# EAGLE design micamp (EAGLE 6.4)
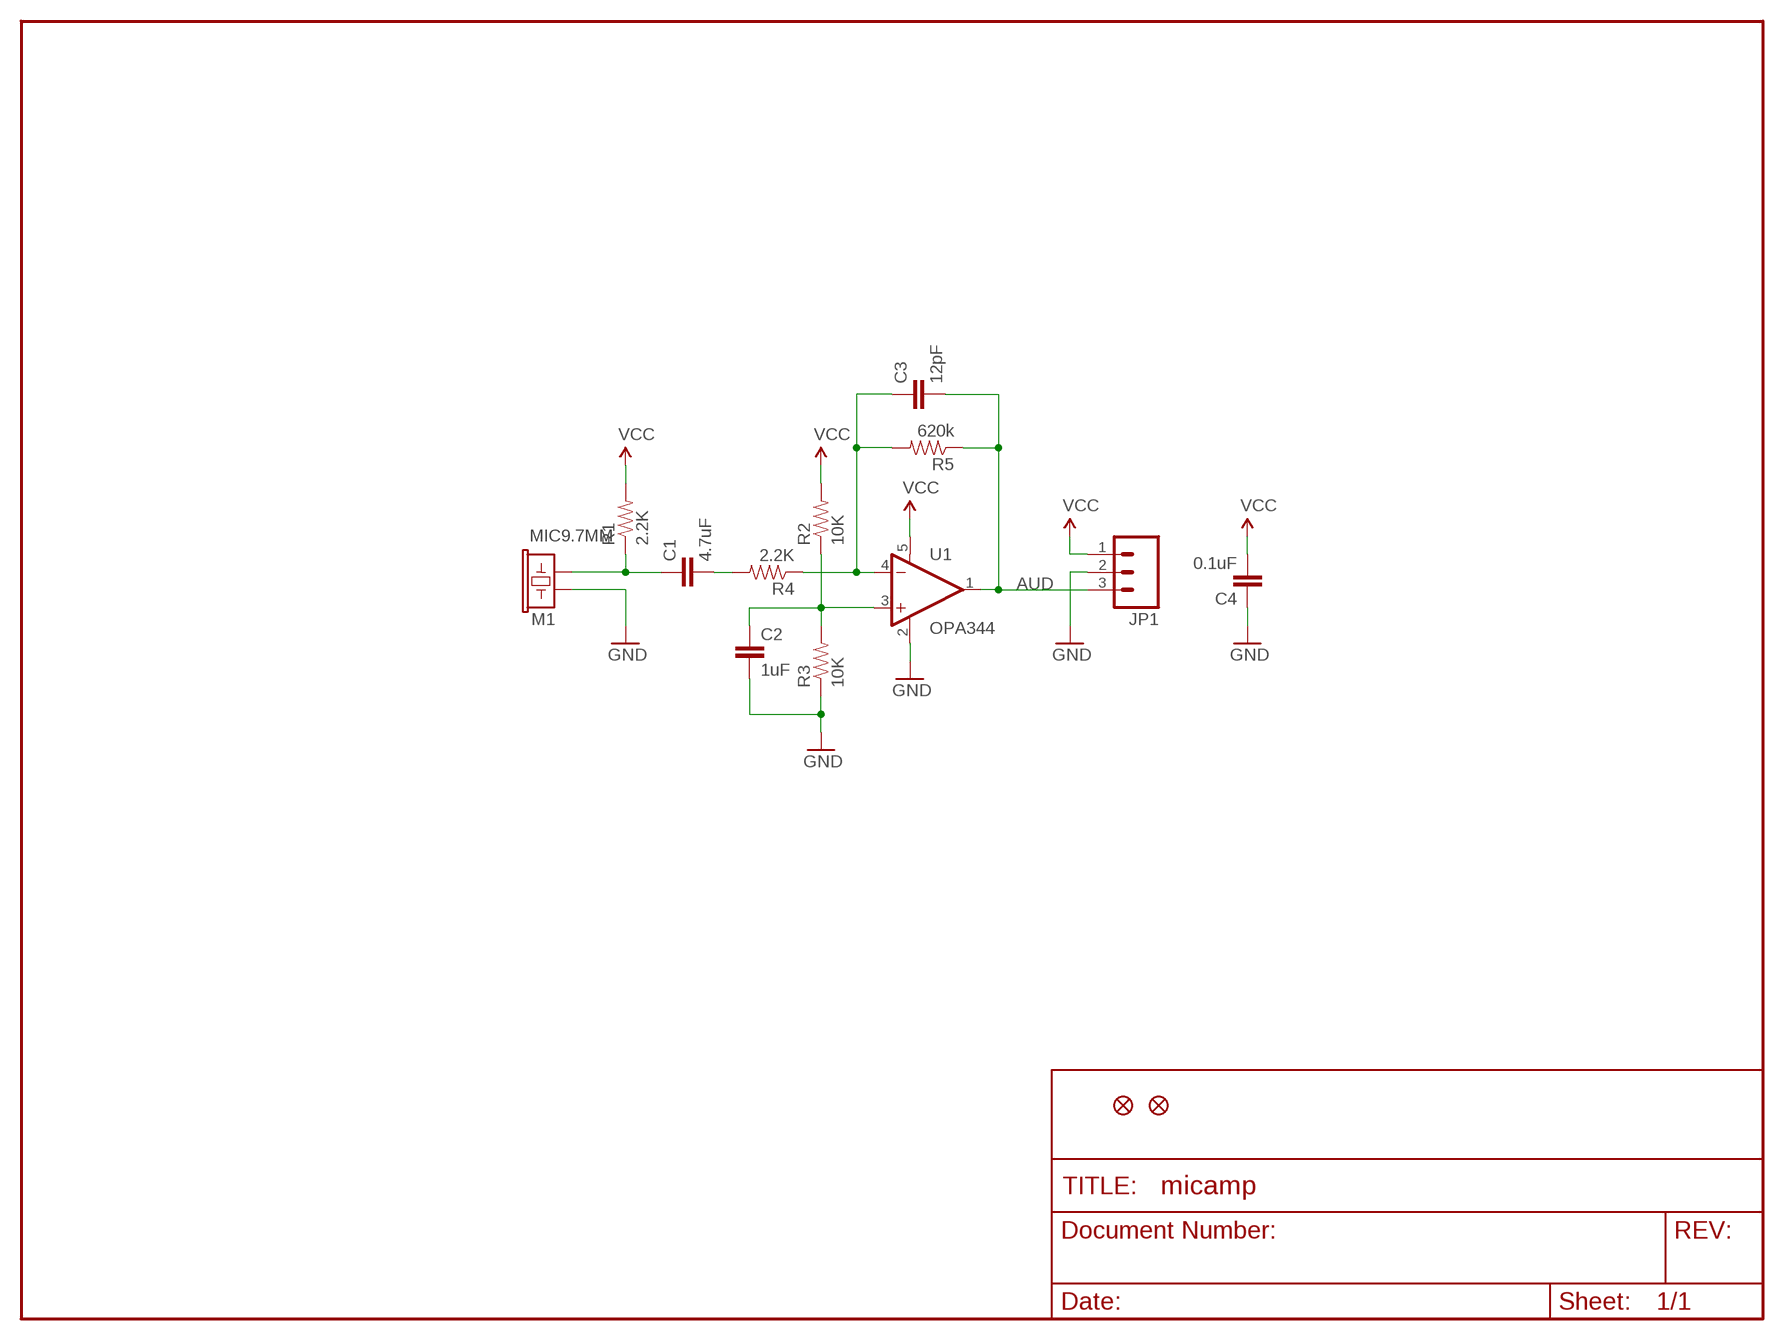
[diagram p0: schematic, sheet 1]

## Parts
C1  4.7uF  CAP0603-CAP  [0603-CAP]
C2  1uF  CAP0603-CAP  [0603-CAP]
C3  12pF  CAP0603-CAP  [0603-CAP]
C4  0.1uF  CAP0603-CAP  [0603-CAP]
JP1  M03PTH  [1X03]
JP2  FIDUCIAL1X2  [FIDUCIAL-1X2]
JP3  FIDUCIAL1X2  [FIDUCIAL-1X2]
M1  MIC9.7MM  [MIC-9.7MM]
R1  2.2K  RESISTOR0603-RES  [0603-RES]
R2  10K  RESISTOR0603-RES  [0603-RES]
R3  10K  RESISTOR0603-RES  [0603-RES]
R4  2.2K  RESISTOR0603-RES  [0603-RES]
R5  620k  RESISTOR0603-RES  [0603-RES]
U1  OPA344  [SOT23-5]

## Nets
AUD: C3.2 JP1.3 R5.1 U1.1(OUT)
GND: C2.2 C4.1 JP1.2 M1.2 R3.1 U1.2(V-)
N$1: C1.1 M1.1 R1.1
N$2: C3.1 R4.1 R5.2 U1.4(-IN)
N$6: C1.2 R4.2
N$7: C2.1 R2.1 R3.2 U1.3(+IN)
VCC: C4.2 JP1.1 R1.2 R2.2 U1.5(V+)

## Library data of the parts
C1-C4 = SparkFun:CAP: Capacitor Standard 0603 ceramic capacitor, and 0.1" leaded capacitor.
JP1 = SparkFun:M03: Header 3 Standard 3-pin 0.1" header. Use with straight break away headers (SKU : PRT-00116), right angle break away headers (PRT-00553), swiss pins (PRT-00743), machine pins (PRT-00117), and female headers (PRT-00115). Molex polarized connector foot print use with SKU : PRT-08232 with associated crimp pins and housings.
JP2 JP3 = SparkFun:FIDUCIAL: Fiducial Alignment Points Various fiducial points for machine vision alignment.
M1 = SparkFun:MIC: Microphone Omni-directional electret microphone. 9.7mm standard diameter.
R1-R5 = SparkFun:RESISTOR: Resistor Basic schematic elements and footprints for 0603, 1206, and PTH 1/10th watt (small) resistors.
U1 = SparkFun:OPA344

## Board
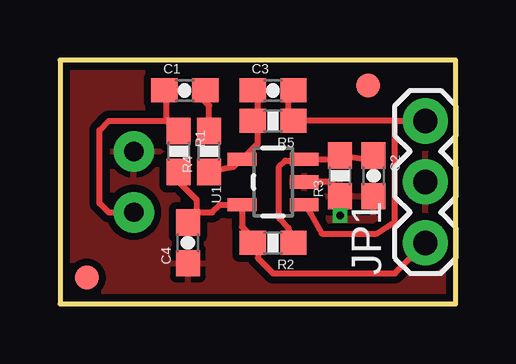
[diagram p1: board, top side]
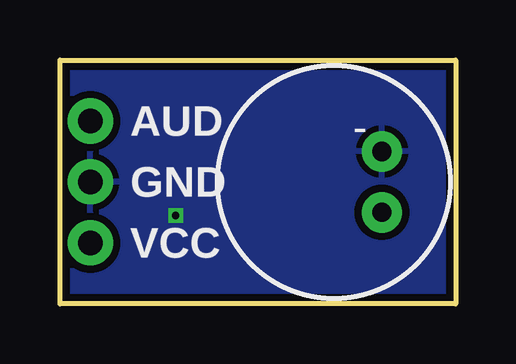
[diagram p2: board, bottom side, seen from below]

Size 16.51 x 10.16 mm. Coordinates in mm from the lower left corner, seen from the top.
Outline: 0,0 16.51,0 16.51,10.16 0,10.16 0,0
Copper layers (1*16): Top 0.035mm / dielectric 1.5mm / Bottom 0.035mm
Design rules "Fusion_eagle_rule_v1.1": minimum track width 6mil, minimum drill 12mil, track to track 6mil, track to pad 6mil, pad to pad 6mil, via to via 6mil, smd to smd 0mil, copper to edge 10mil, drill to drill 10mil, minimum pad ring 10mil, minimum via ring 6mil, stop-mask expansion 2mil, vias tented up to drill 100mil, thermal gap 10mil

### Footprints (pad centres in the part's own frame; a part is rotated, then mirrored left to right if it is on the bottom)
0603-CAP = smd 1.1 x 1: 1 -0.85,0; 2 0.85,0
1X03 = drill 1.016 pad 1.88: 1 0,0; 2 2.54,0; 3 5.08,0
FIDUCIAL-1X2 = smd 1 x 1: 1 0,0
MIC-9.7MM = drill 0.8 pad 1.676: 1 -2,1.27; 2 -2,-1.27
0603-RES = smd 1.1 x 1: 1 -0.85,0; 2 0.85,0
SOT23-5 = smd 0.55 x 1.2: 1 -0.95,-1.3; 2 0,-1.3; 3 0.95,-1.3; 4 0.95,1.3; 5 -0.95,1.3

### Placement (x,y rotation side)
C1  5.21,8.89 0 top
C2  13.08,5.33 270 top
C3  8.89,8.89 0 top
C4  5.33,2.54 90 top
JP1  15.24,2.54 90 top
JP2  12.85,9.09 0 top
JP3  1.12,1.09 0 top
M1  5.08,5.08 180 bottom
R1  4.95,6.35 270 top
R2  8.89,2.54 180 top
R3  11.68,5.33 90 top
R4  6.22,6.35 90 top
R5  8.89,7.62 180 top
U1  8.89,5.08 90 top

### Tracks (layer width: path | path; a pad name or v marks a point on that pad's centre or on a via)
AUD
  Top 0.254: 9.53,7.61 9.53,7.49 | 9.53,7.61 R5.1 13.97,7.62 | C3.2 9.53,8.88 9.53,7.61 | 13.97,7.62 JP1.3 | U1.1 10.44,3.78 10.92,2.92 13.21,2.92 13.97,3.43 13.97,7.62
GND  (via drill 0.3)
  Top 0.254: 10.16,5.08 U1.2 11.3,5.08 11.68,4.7 R3.1
  other vias: 11.68,3.68
  pour Bottom (isolate 0.305): 0,0 0,10.16 16.51,10.16 16.51,0
  pour Top (isolate 0.305): 0,0 0,10.16 16.51,10.16 16.51,0
N$1
  Top 0.254: R1.1 5.08,6.99 | M1.1 2.03,3.81 1.65,4.19 1.65,7.24 2.03,7.62 4.45,7.62 | C1.1 4.45,8.89 4.45,7.62 | R1.1 4.95,6.99 | R1.1 4.95,7.11 4.45,7.62
N$2
  Top 0.254: C3.1 8.26,8.88 8.26,7.63 R5.2 8.26,7.62 8.26,6.7 U1.4 7.55,6.03 7.22,5.7 R4.1
N$6
  Top 0.254: C1.2 5.73,8.78 5.71,8.76 6.22,8.26 R4.2
N$7
  Top 0.254: 10.16,5.97 10.16,6 U1.3 | C2.1 13.08,5.97 13.07,5.98 R3.2 11.68,5.97 11.62,6.03 U1.3 | R2.1 9.54,3.16 9.14,3.56 9.14,5.71 9.4,5.97 10.16,5.97 | 10.16,5.97 10.19,6 U1.3
VCC
  Top 0.254: JP1.1 13.97,1.27 8.89,1.27 8.26,1.91 8.26,2.54 | R1.2 5.21,5.57 | 5.71,3.81 5.71,4.32 4.95,5.08 R1.2 | R1.2 5.08,5.71 | C4.2 5.71,3.81 | 5.71,3.81 6.35,3.81 6.67,4.13 U1.5 7.59,3.21 8.26,2.54 | 8.26,2.54 R2.2

### Text on the board
bPlace: AUD | GND | VCC
tValues: DNP | Mic on opposite side | Mic Breakout